# EAGLE design rwqs (EAGLE 9.6.2)
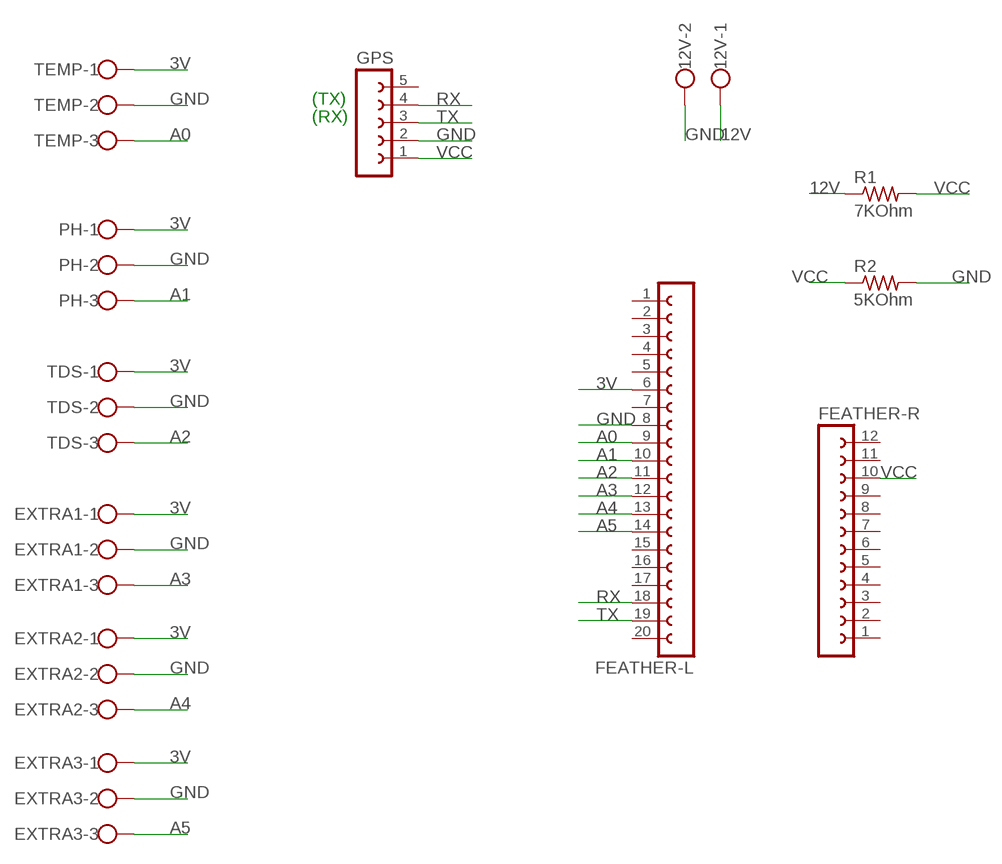
[diagram p0: schematic, sheet 1]

## Parts
12V  W237-113  [W237-113]
EXTRA1  W237-103  [W237-103]
EXTRA2  W237-103  [W237-103]
EXTRA3  W237-103  [W237-103]
FEATHER-L  FE20-1  [FE20]
FEATHER-R  FE12-1  [FE12]
GPS  FE05-1  [FE05-1]
PH  W237-103  [W237-103]
R1  7KOhm  R-US_0204/2V  [0204V]
R2  5KOhm  R-US_0204/2V  [0204V]
TDS  W237-103  [W237-103]
TEMP  W237-103  [W237-103]

## Nets
3V: EXTRA1.1 EXTRA2.1 EXTRA3.1 FEATHER-L.6 PH.1 TDS.1 TEMP.1
12V: 12V.1 R1.1
A0: FEATHER-L.9 TEMP.3
A1: FEATHER-L.10 PH.3
A2: FEATHER-L.11 TDS.3
A3: EXTRA1.3 FEATHER-L.12
A4: EXTRA2.3 FEATHER-L.13
A5: EXTRA3.3 FEATHER-L.14
GND: 12V.2 EXTRA1.2 EXTRA2.2 EXTRA3.2 FEATHER-L.8 GPS.2 PH.2 R2.2 TDS.2 TEMP.2
RX: FEATHER-L.18 GPS.4
TX: FEATHER-L.19 GPS.3
VCC: FEATHER-R.10 GPS.1 R1.2 R2.1
Unconnected: FEATHER-L.1 FEATHER-L.2 FEATHER-L.3 FEATHER-L.4 FEATHER-L.5 FEATHER-L.7 FEATHER-L.15 FEATHER-L.16 FEATHER-L.17 FEATHER-L.20 FEATHER-R.1 FEATHER-R.2 FEATHER-R.3 FEATHER-R.4 FEATHER-R.5 FEATHER-R.6 FEATHER-R.7 FEATHER-R.8 FEATHER-R.9 FEATHER-R.11 FEATHER-R.12 GPS.5

## Notes on the sheet
- (TX)
- (RX)

## Library data of the parts
12V = con-wago-500:W237-113: WAGO SCREW CLAMP; OC_FARNELL: unknown; OC_NEWARK: unknown
EXTRA1-EXTRA3 PH TDS TEMP = con-wago-500:W237-103: WAGO SCREW CLAMP; MPN: 237-103; OC_FARNELL: unknown; OC_NEWARK: 18M7116
FEATHER-L = con-lsta:FE20-1: FEMALE HEADER; OC_FARNELL: unknown; OC_NEWARK: unknown
FEATHER-R = con-lsta:FE12-1: FEMALE HEADER; OC_FARNELL: unknown; OC_NEWARK: unknown
GPS = con-lsta:FE05-1: FEMALE HEADER; OC_FARNELL: unknown; OC_NEWARK: unknown
R1 R2 = rcl:R-US_: RESISTOR, American symbol; SPICEPREFIX: R

## Board
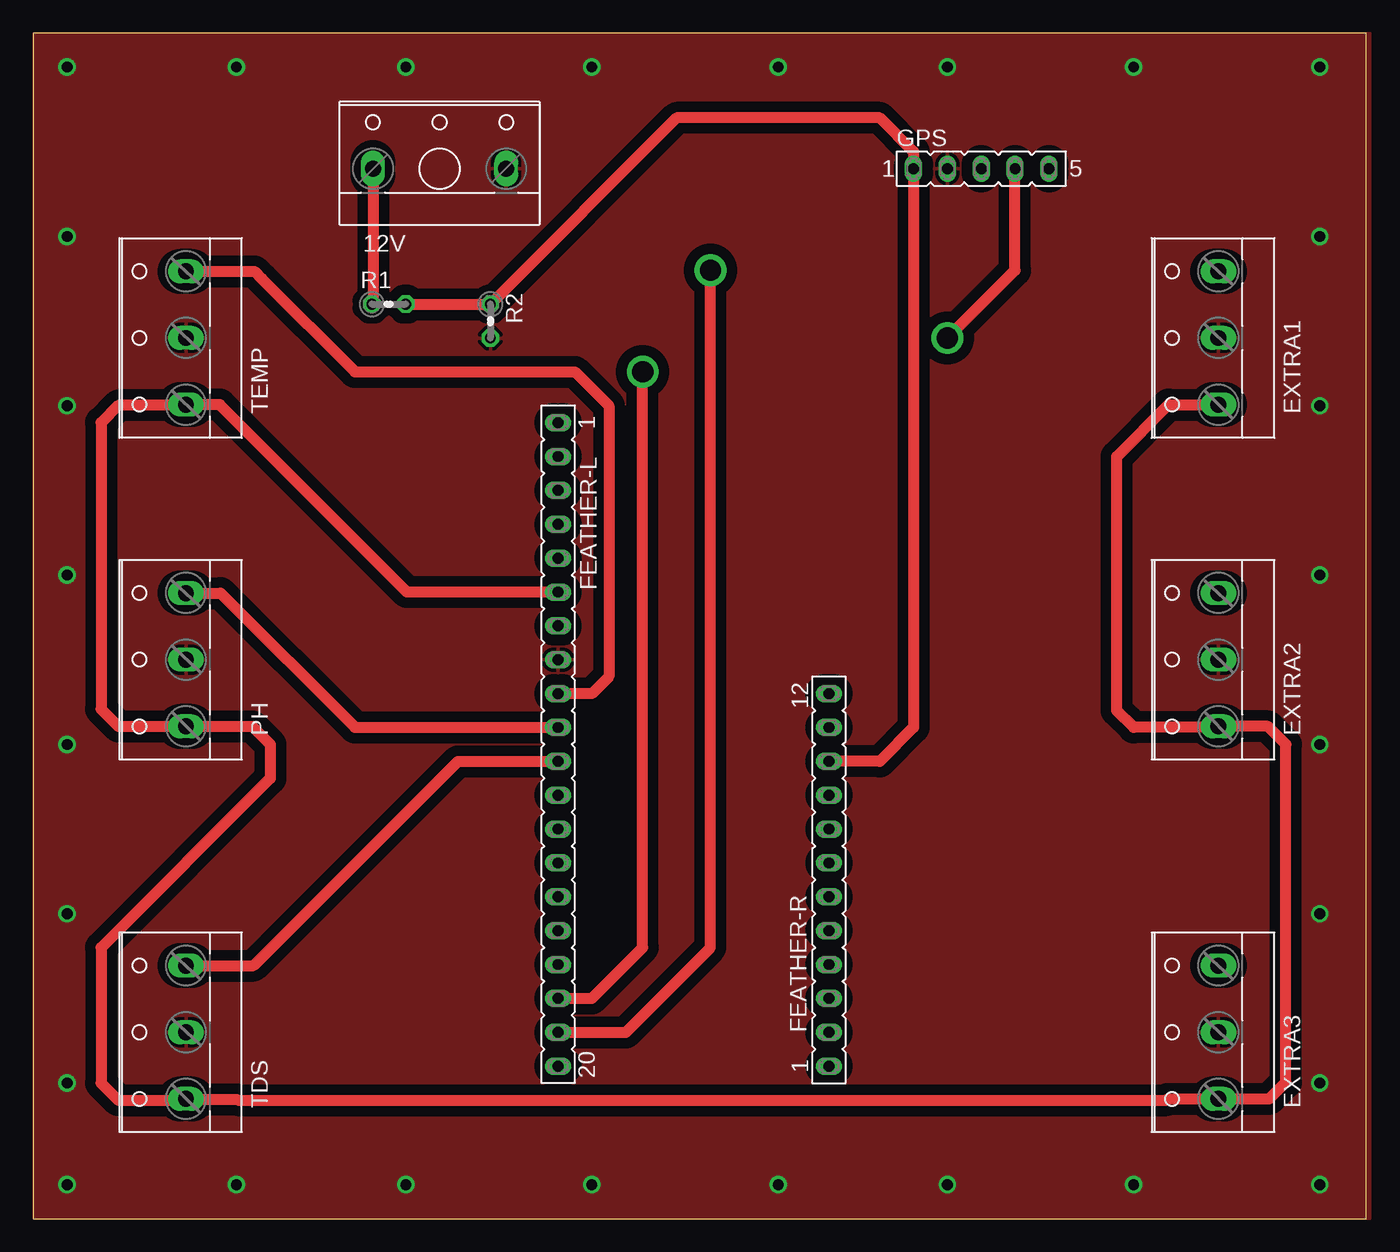
[diagram p1: board, top side]
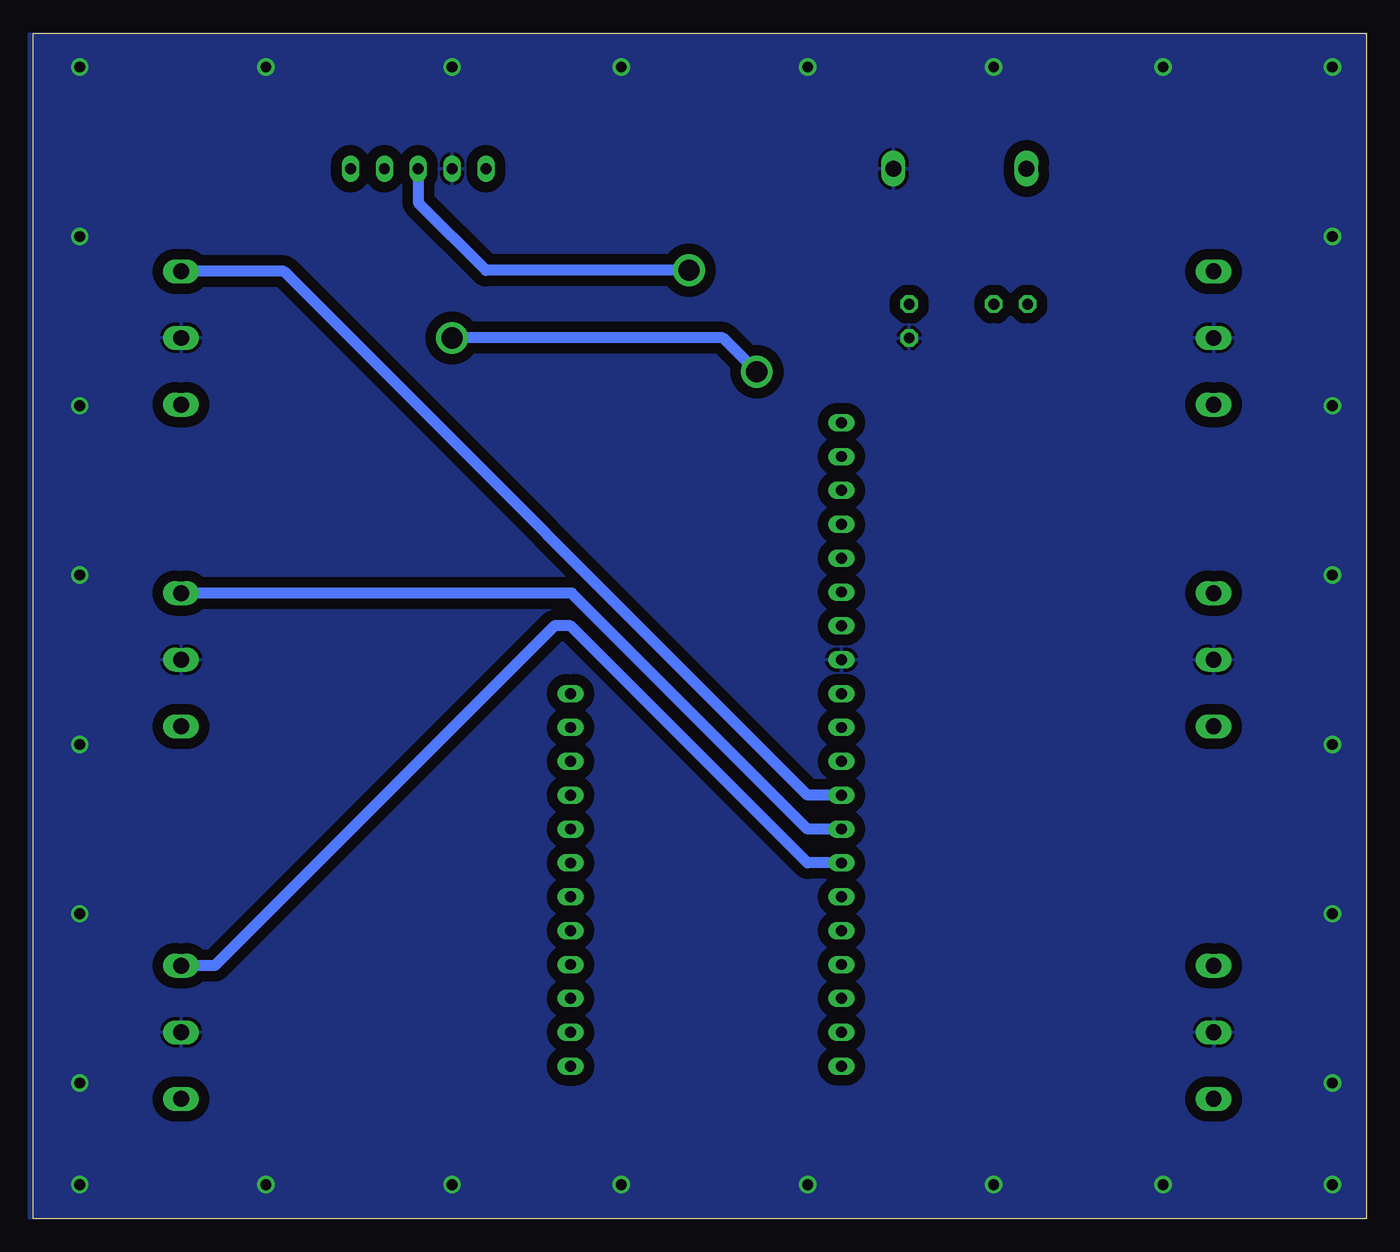
[diagram p2: board, bottom side, seen from below]

Size 100 x 88.89 mm. Coordinates in mm from the lower left corner, seen from the top.
Outline: 0,0 100,0 100,88.89 0,88.89 0,0
Copper layers (1*16): Top 0.035mm / dielectric 1.5mm / Bottom 0.035mm
Design rules "OthermillDRC_1_32_v2": minimum track width 8mil, minimum drill 0.8mm, track to track 0.794003125mm, track to pad 0.794003125mm, pad to pad 0.794003125mm, via to via 0.794003125mm, smd to smd 0mil, copper to edge 0mil, drill to drill 1mil, minimum pad ring 10mil, minimum via ring 10mil, stop-mask expansion 1mil, vias tented up to drill 30mil, thermal gap 10mil

### Footprints (pad centres in the part's own frame; a part is rotated, then mirrored left to right if it is on the bottom)
W237-113 = drill 1.194 long: 1 -5,-1.27; 2 5,-1.27
W237-103 = drill 1.194 long: 1 -5,-1.29; 2 0,-1.29; 3 5,-1.29
FE20 = drill 0.813 long: 1 -24.13,0; 2 -21.59,0; 3 -19.05,0; 4 -16.51,0; 5 -13.97,0; 6 -11.43,0; 7 -8.89,0; 8 -6.35,0; 9 -3.81,0; 10 -1.27,0; 11 1.27,0; 12 3.81,0; 13 6.35,0; 14 8.89,0; 15 11.43,0; 16 13.97,0; 17 16.51,0; 18 19.05,0; 19 21.59,0; 20 24.13,0
FE12 = drill 0.813 long: 1 -13.97,0; 2 -11.43,0; 3 -8.89,0; 4 -6.35,0; 5 -3.81,0; 6 -1.27,0; 7 1.27,0; 8 3.81,0; 9 6.35,0; 10 8.89,0; 11 11.43,0; 12 13.97,0
FE05-1 = drill 0.813 long: 1 -5.08,0; 2 -2.54,0; 3 0,0; 4 2.54,0; 5 5.08,0
0204V = drill 0.813 octagon: 1 -1.27,0; 2 1.27,0

### Placement (x,y rotation side)
12V  30.48,80.01 0 top
EXTRA1  87.63,66.04 90 top
EXTRA2  87.63,41.91 90 top
EXTRA3  87.63,13.97 90 top
FEATHER-L  39.37,35.56 270 top
FEATHER-R  59.69,25.4 90 top
GPS  71.12,78.74 0 top
PH  10.16,41.91 90 top
R1  26.67,68.58 0 top
R2  34.29,67.31 270 top
TDS  10.16,13.97 90 top
TEMP  10.16,66.04 90 top

### Tracks (layer width: path | path; a pad name or v marks a point on that pad's centre or on a via)
3V
  Top 0.813: FEATHER-L.6 28.04,46.99 13.99,61.04 TEMP.1 11.39,60.98 6.37,60.98 5.08,59.69 5.08,38.2 6.37,36.91 PH.1 16.43,36.91 17.78,35.56 17.78,33.02 5.08,20.32 5.08,10.16 6.35,8.89 11.43,8.89 11.48,8.94 | TDS.1 11.48,8.94 | 11.48,8.94 15.29,8.94 15.34,8.89 85.03,8.89 85.11,8.97 EXTRA3.1 92.73,8.97 93.98,10.22 93.98,35.56 92.63,36.91 EXTRA2.1 88.84,36.83 82.55,36.83 81.28,38.1 81.28,57.15 85.17,61.04 EXTRA1.1
12V
  Top 0.813: 12V.1 25.48,68.66 R1.1
A0
  Top 0.813: TEMP.3 16.59,71.04 17.14,70.48 24.13,63.5 40.64,63.5 43.18,60.96 43.18,40.64 41.91,39.37 FEATHER-L.9
A1
  Top 0.813: PH.3 14.05,46.91 24.13,36.83 FEATHER-L.10
A2
  Top 0.813: TDS.3 16.53,18.97 31.85,34.29 FEATHER-L.11
A3
  Bottom 0.813: FEATHER-L.12 41.91,31.75 81.2,71.04 EXTRA1.3
A4
  Bottom 0.813: FEATHER-L.13 41.91,29.21 59.61,46.91 EXTRA2.3
A5
  Bottom 0.813: FEATHER-L.14 41.91,26.67 59.69,44.45 60.9,44.45 86.38,18.97 EXTRA3.3
GND  (via drill 0.8)
  other vias: 2.54,86.36 2.54,73.66 2.54,60.96 2.54,48.26 2.54,35.56 2.54,22.86 2.54,10.16 2.54,2.54 15.24,2.54 27.94,2.54 41.91,2.54 55.88,2.54 68.58,2.54 82.55,2.54 96.52,2.54 96.52,10.16 96.52,22.86 96.52,35.56 96.52,48.26 96.52,60.96 96.52,73.66 96.52,86.36 82.55,86.36 68.58,86.36 55.88,86.36 41.91,86.36 27.94,86.36 15.24,86.36
  pour Bottom: 0,0 100.33,0 100.33,88.9 0,88.9
  pour Top: 0,0 100.33,0 100.33,88.9 0,88.9
RX  (via drill 1.59)
  Top 0.813: FEATHER-L.18 41.91,16.51 45.72,20.32 v45.72,63.5 | v68.58,66.04 73.66,71.12 GPS.4
  Bottom 0.813: v45.72,63.5 48.26,66.04 v68.58,66.04
TX  (via drill 1.59)
  Top 0.813: FEATHER-L.19 44.45,13.97 50.8,20.32 v50.8,71.12
  Bottom 0.813: v50.8,71.12 66.04,71.12 71.12,76.2 GPS.3
VCC
  Top 0.813: R1.2 R2.1 48.26,82.55 63.5,82.55 66.04,80.01 GPS.1 66.04,36.83 63.5,34.29 FEATHER-R.10